# EAGLE design main (EAGLE 6.6.0)
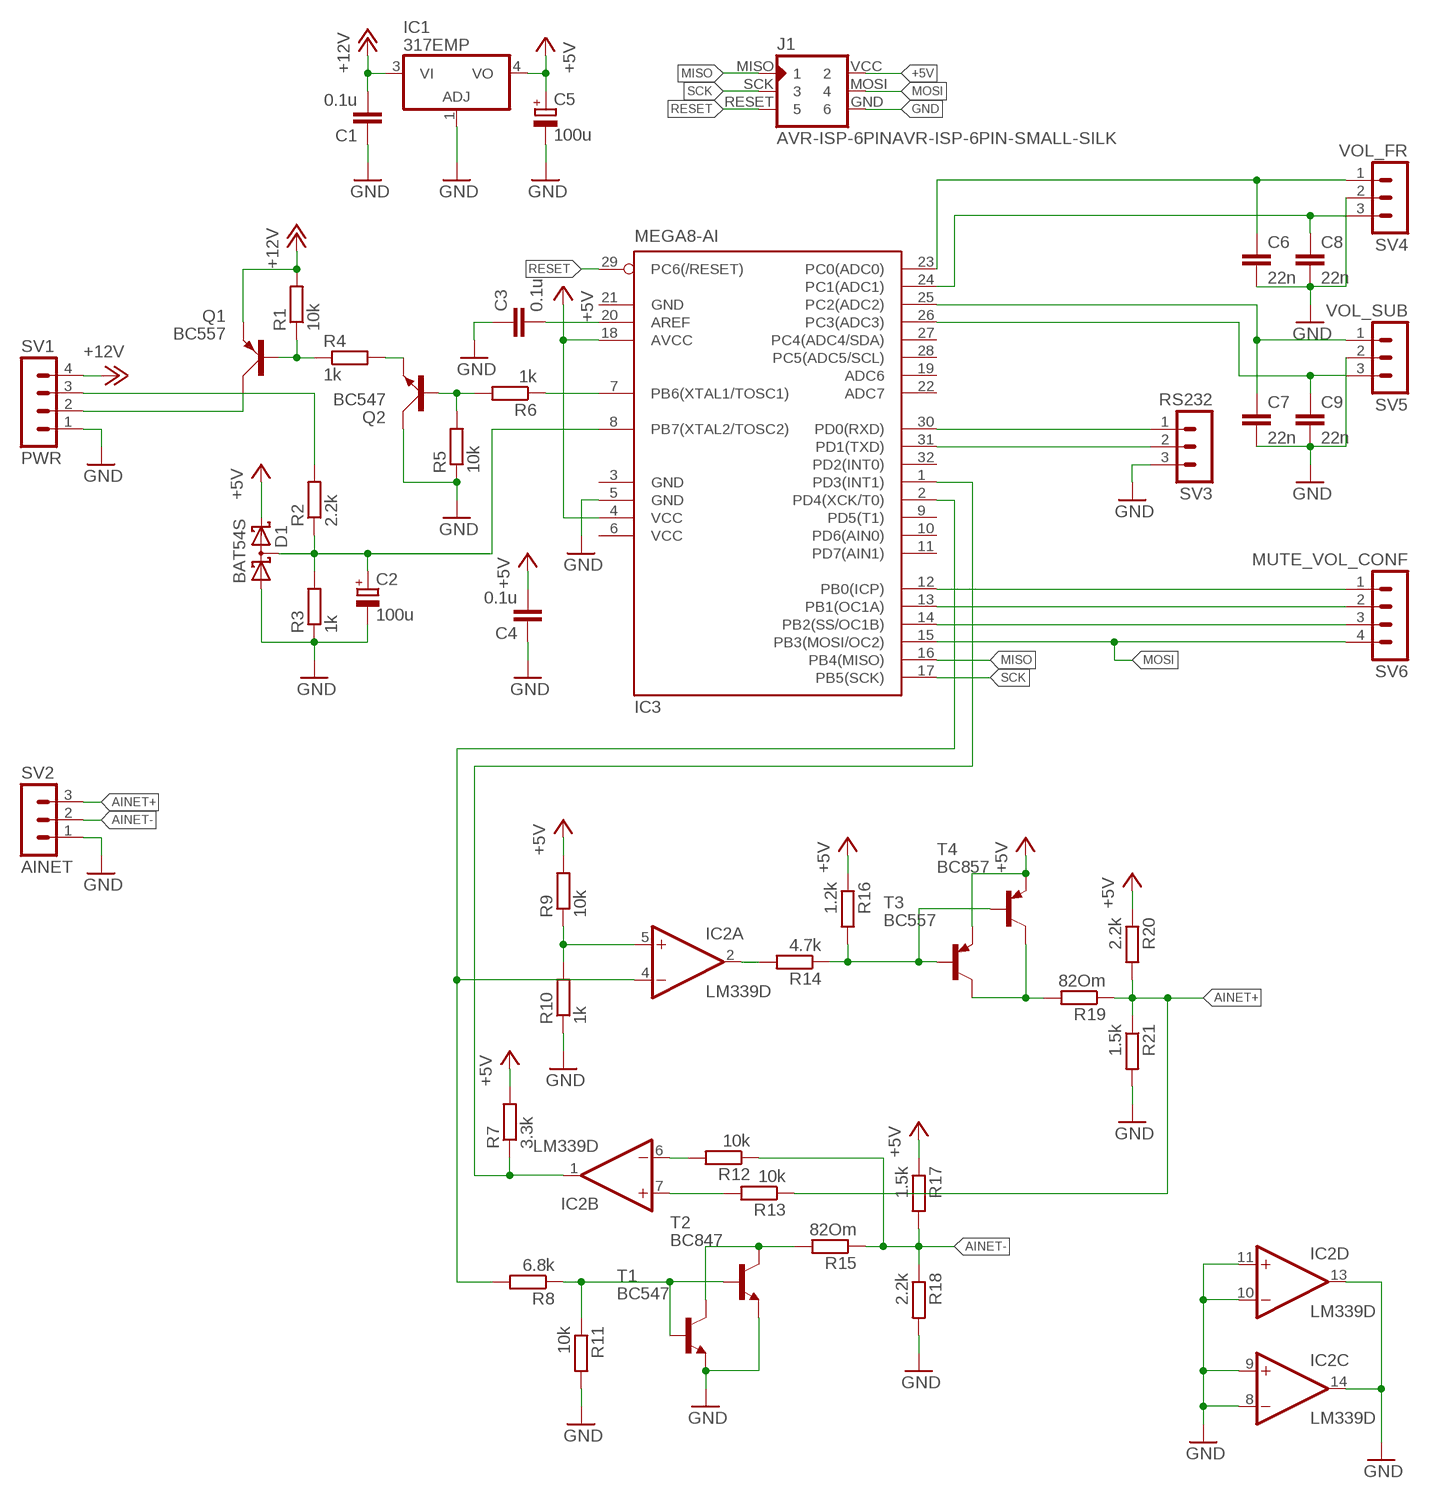
[diagram p0: schematic, sheet 1]

## Parts
C1  0.1u  C-EUC0805  [C0805]
C2  100u  CPOL-EUE3.5-8  [E3,5-8]
C3  0.1u  C-EUC0805  [C0805]
C4  0.1u  C-EUC0805  [C0805]
C5  100u  CPOL-EUE3.5-8  [E3,5-8]
C6  22n  C-EUC0805  [C0805]
C7  22n  C-EUC0805  [C0805]
C8  22n  C-EUC0805  [C0805]
C9  22n  C-EUC0805  [C0805]
D1  BAT54S  [SOT23]
IC1  317EMP  [SOT223]
IC2  LM339D  [SO14]
IC3  MEGA8-AI  [TQFP32-08]
J1  AVR-ISP-6PINAVR-ISP-6PIN-SMALL-SILK  [AVR-ISP-6PIN-SMAILL-SILK]
Q1  BC557  [SOT54A]
Q2  BC547  [SOT54A]
R1  10k  R-EU_R0805  [R0805]
R2  2.2k  R-EU_R0805  [R0805]
R3  1k  R-EU_R0805  [R0805]
R4  1k  R-EU_R0805  [R0805]
R5  10k  R-EU_R0805  [R0805]
R6  1k  R-EU_R0805  [R0805]
R7  3.3k  R-EU_R0805  [R0805]
R8  6.8k  R-EU_R0805  [R0805]
R9  10k  R-EU_R0805  [R0805]
R10  1k  R-EU_R0805  [R0805]
R11  10k  R-EU_R0805  [R0805]
R12  10k  R-EU_R0805  [R0805]
R13  10k  R-EU_R0805  [R0805]
R14  4.7k  R-EU_R0805  [R0805]
R15  82Om  R-EU_R0805  [R0805]
R16  1.2k  R-EU_R0805  [R0805]
R17  1.5k  R-EU_R0805  [R0805]
R18  2.2k  R-EU_R0805  [R0805]
R19  82Om  R-EU_R0805  [R0805]
R20  2.2k  R-EU_R0805  [R0805]
R21  1.5k  R-EU_R0805  [R0805]
SV1  PWR  MA04-1  [MA04-1]
SV2  AINET  MA03-1  [MA03-1]
SV3  RS232  MA03-1  [MA03-1]
SV4  VOL_FR  MA03-1  [MA03-1]
SV5  VOL_SUB  MA03-1  [MA03-1]
SV6  MUTE_VOL_CONF  MA04-1  [MA04-1]
T1  BC547  BC547-NPN-TO92-CBE  [TO92-CBE]
T2  BC847  BC847-NPN-SOT23-BEC  [SOT23-BEC]
T3  BC557  BC557A-PNP-TO92-EBC  [TO92-EBC]
T4  BC857  BC857A-PNP-SOT23-BEC  [SOT23-BEC]

## Nets
+5V: C4.2 C5.+ D1.2(C2) IC1.4(VO) IC3.4(VCC) IC3.18(AVCC) J1.VCC R7.2 R9.2 R16.1 R17.1 R20.1 T3.E T4.E
+12V: C1.2 IC1.3(VI) Q1.E R1.2 SV1.4
AINET+: R13.1 R19.1 R20.2 R21.1 SV2.3
AINET-: R12.1 R15.1 R17.2 R18.1 SV2.2
GND: C1.1 C2.- C3.1 C4.1 C5.- C6.2 C7.2 C8.2 C9.2 D1.1(A1) IC1.1(ADJ) IC2.8(C:-IN) IC2.9(C:+IN) IC2.10(D:-IN) IC2.11(D:+IN) IC2.13(D:OUT) IC2.14(C:OUT) IC3.5(GND) J1.GND Q2.C R3.1 R5.1 R10.1 R11.2 R18.2 R21.2 SV1.1 SV2.1 SV3.3 SV4.2 SV5.2 T1.E T2.E
MISO: IC3.16(PB4(MISO)) J1.MISO
MOSI: IC3.15(PB3(MOSI/OC2)) J1.MOSI SV6.4
N$1: C8.1 IC3.24(PC1(ADC1)) SV4.3
N$2: C6.1 IC3.23(PC0(ADC0)) SV4.1
N$3: C2.+ D1.3(C1A2) IC3.8(PB7(XTAL2/TOSC2)) R2.1 R3.2
N$4: IC3.12(PB0(ICP)) SV6.1
N$5: C9.1 IC3.26(PC3(ADC3)) SV5.3
N$6: C7.1 IC3.25(PC2(ADC2)) SV5.1
N$7: IC3.13(PB1(OC1A)) SV6.2
N$8: IC3.14(PB2(SS/OC1B)) SV6.3
N$9: Q2.B R5.2 R6.2
N$10: R2.2 SV1.3
N$11: IC3.7(PB6(XTAL1/TOSC1)) R6.1
N$12: Q2.E R4.2
N$13: Q1.B R1.1 R4.1
N$14: Q1.C SV1.2
N$15: IC3.30(PD0(RXD)) SV3.1
N$16: C3.2 IC3.20(AREF)
N$18: IC2.5(A:+IN) R9.1 R10.2
N$19: IC2.1(B:OUT) IC3.1(PD3(INT1)) R7.1
N$20: IC2.4(A:-IN) IC3.2(PD4(XCK/T0)) R8.2
N$21: R14.1 R16.2 T3.B T4.B
N$22: IC2.2(A:OUT) R14.2
N$23: IC2.6(B:-IN) R12.2
N$24: R19.2 T3.C T4.C
N$25: IC2.7(B:+IN) R13.2
N$26: IC3.31(PD1(TXD)) SV3.2
N$27: R15.2 T1.C T2.C
N$29: R8.1 R11.1 T1.B T2.B
RESET: IC3.29(PC6(/RESET)) J1.RESET
SCK: IC3.17(PB5(SCK)) J1.SCK
Unconnected: IC3.9(PD5(T1)) IC3.10(PD6(AIN0)) IC3.11(PD7(AIN1)) IC3.19(ADC6) IC3.22(ADC7) IC3.27(PC4(ADC4/SDA)) IC3.28(PC5(ADC5/SCL)) IC3.32(PD2(INT0))

## Power pins joined to a net without a drawn wire
GND: IC2.12(P:GND) IC3.3(GND) IC3.21(GND)
V+: IC2.3(P:V+)
VCC: IC3.6(VCC)

## Library data of the parts
C1 C3 C4 C6-C9 = rcl:C-EU: CAPACITOR, European symbol
C2 C5 = rcl:CPOL-EU: POLARIZED CAPACITOR, European symbol
D1 = diode:BAT54S: Schottky Diodes Pin connection corrected 2011-05-04 Source: Fairchild .. BAT54.pdf
IC1 = linear:*317: Positive VOLTAGE REGULATOR
IC2 = linear:LM339: Low Power Low Offset Voltage Quad Comparators with open collector; LM139/LM239/LM339/LM2901/LM3302
IC3 = atmel:MEGA8: MICROCONTROLLER 8 Kbytes FLASH, 1 kbytes SRAM, 512 bytes EEPROM, USART, 6-channel 10 bit ADC, 2-channel 8 bit ADC Pin compatible with Atmega48, ATMega88, ATMega168 Source: avr.lbr; MPN: ATMEGA8-16AU; OC_FARNELL: 9171371; OC_NEWARK: 73M8863
J1 = avr-isp:AVR-ISP-6PIN: AVR ISP 6pin 3x2 pin header
Q1 = transistor-small-signal:BC557: PNP TRANSISTOR
Q2 = transistor-small-signal:BC547: NPN TRANSISTOR
R1-R21 = rcl:R-EU_: RESISTOR, European symbol
SV1 SV6 = con-lstb:MA04-1: PIN HEADER; OC_FARNELL: unknown; OC_NEWARK: unknown
SV2-SV5 = con-lstb:MA03-1: PIN HEADER; OC_FARNELL: unknown; OC_NEWARK: unknown
T1 T2 = transistor:*-NPN-: NPN Transistror BF959 corrected 2008.03.06
T3 T4 = transistor:*-PNP-: PNP Transistror

## Board
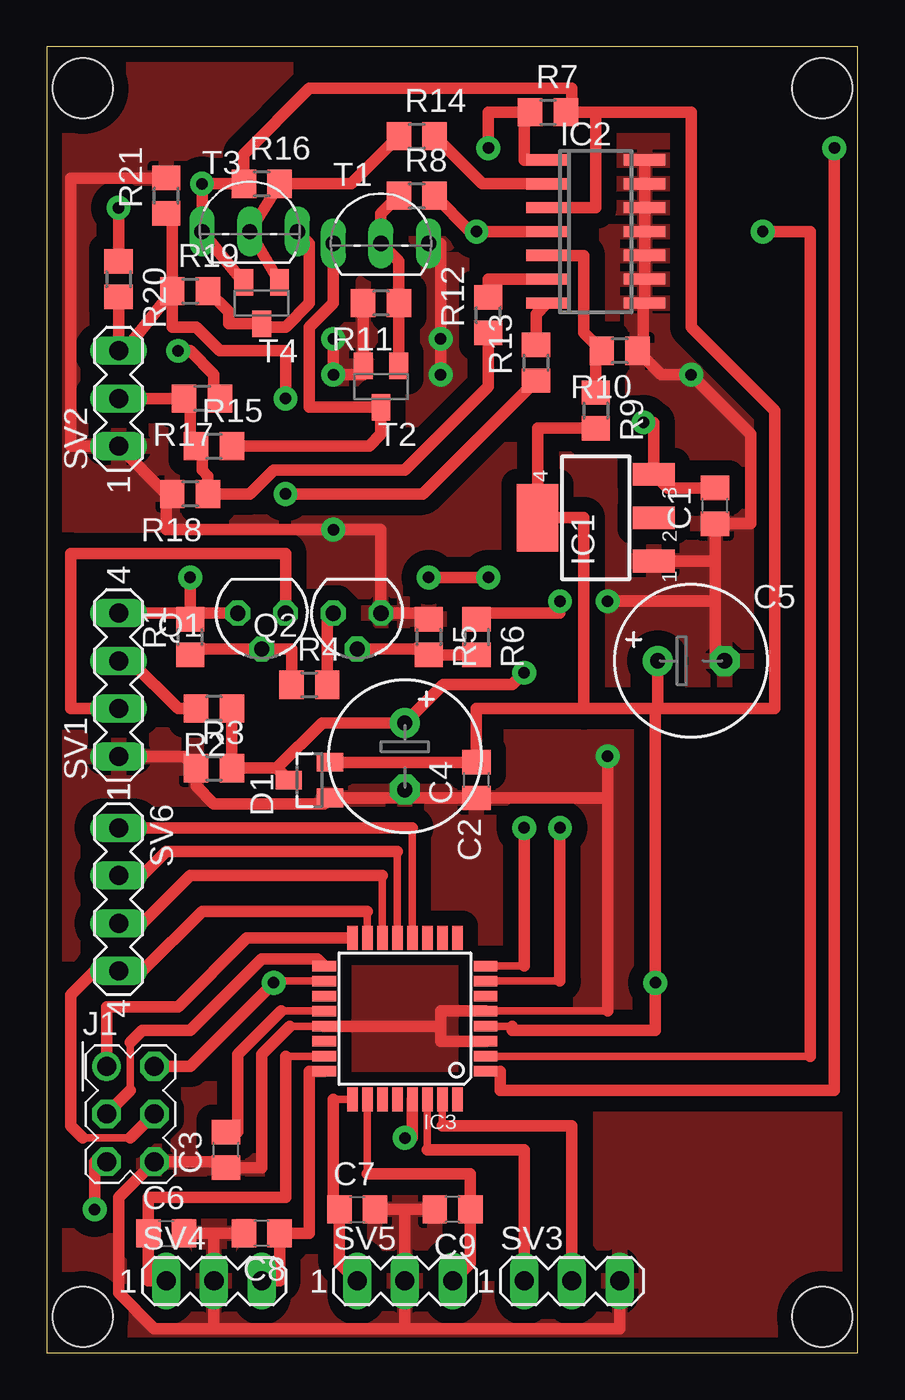
[diagram p1: board, top side]
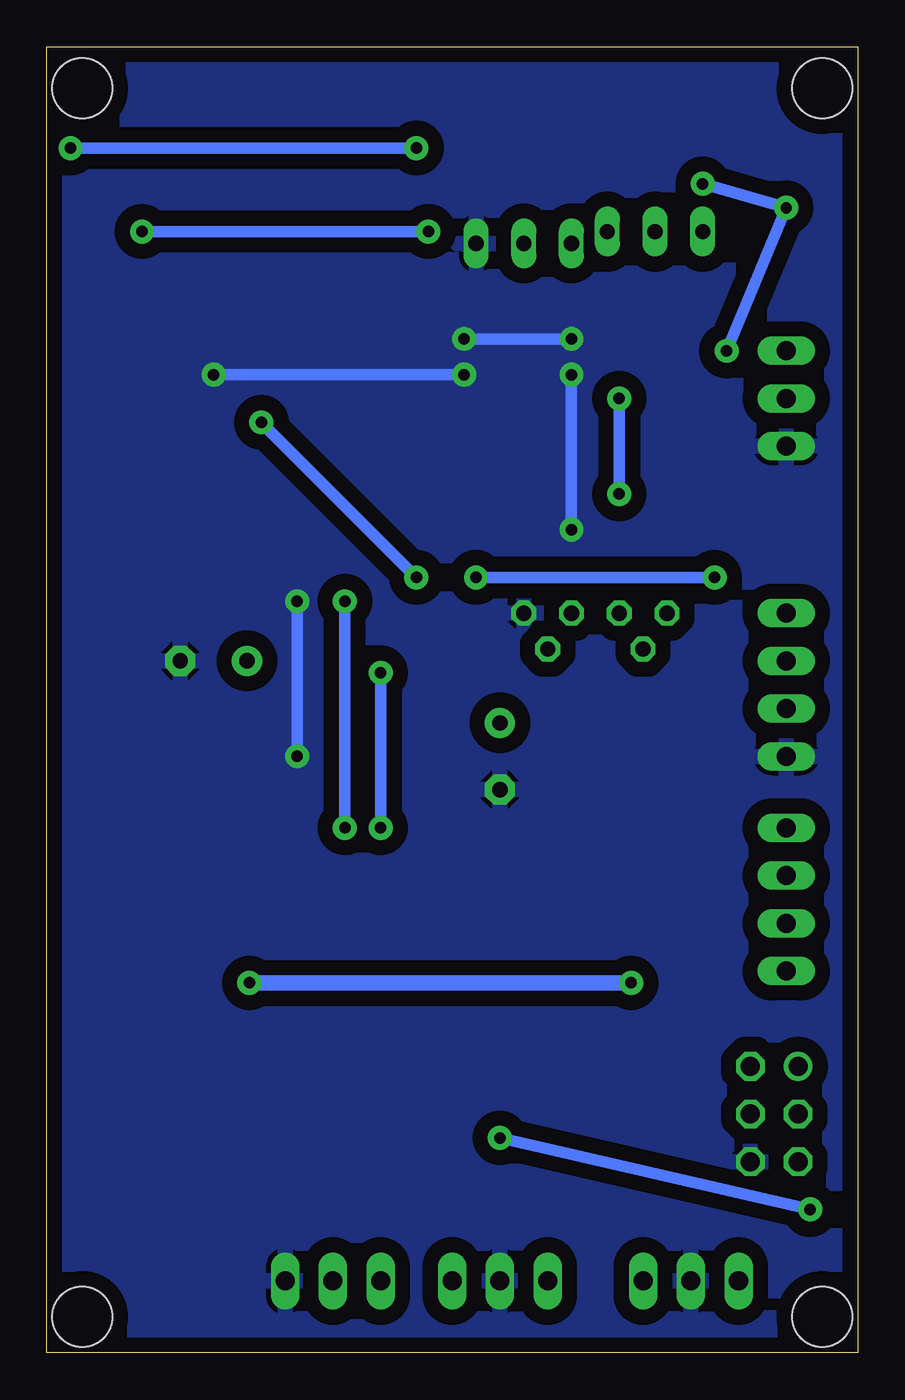
[diagram p2: board, bottom side, seen from below]

Size 43.16 x 69.52 mm. Coordinates in mm from the lower left corner, seen from the top.
Outline: 0,0 43.16,0 43.16,69.52 0,69.52 0,0
Copper layers (1*16): Top 0.035mm / dielectric 1.5mm / Bottom 0.035mm
Design rules "default *": minimum track width 10mil, minimum drill 24mil, track to track 8mil, track to pad 8mil, pad to pad 8mil, via to via 8mil, smd to smd 8mil, copper to edge 0.5mm, drill to drill 8mil, minimum pad ring 10mil, minimum via ring 8mil, stop-mask expansion 4mil, vias tented up to drill 0.5mil, thermal gap 10mil
Holes 3.2 mm at 41.27,1.91 1.91,1.91 1.91,67.31 41.27,67.31

### Footprints (pad centres in the part's own frame; a part is rotated, then mirrored left to right if it is on the bottom)
C0805 = smd 1.3 x 1.5: 1 -0.95,0; 2 0.95,0
E3,5-8 = drill 0.813 pad 1.6: + -1.778,0 | drill 0.813 pad 1.6 octagon: - 1.778,0
SOT23 = smd 1 x 1.4: 1 -0.95,-1.1; 2 0.95,-1.1; 3 0,1.1
SOT223 = smd 1.219 x 2.235: 1 -2.311,-3.099; 2 0,-3.099; 3 2.311,-3.099 | smd 3.6 x 2.2: 4 0,3.099
SO14 = smd 0.6 x 2.2: 1 -3.81,-2.6; 2 -2.54,-2.6; 3 -1.27,-2.6; 4 0,-2.6; 5 1.27,-2.6; 6 2.54,-2.6; 7 3.81,-2.6; 8 3.81,2.6; 9 2.54,2.6; 10 1.27,2.6; 11 0,2.6; 12 -1.27,2.6; 13 -2.54,2.6; 14 -3.81,2.6
TQFP32-08 = smd 1.27 x 0.559: 1 -4.293,2.8; 2 -4.293,2; 3 -4.293,1.2; 4 -4.293,0.4; 5 -4.293,-0.4; 6 -4.293,-1.2; 7 -4.293,-2; 8 -4.293,-2.8; 17 4.293,-2.8; 18 4.293,-2; 19 4.293,-1.2; 20 4.293,-0.4; 21 4.293,0.4; 22 4.293,1.2; 23 4.293,2; 24 4.293,2.8 | smd 0.559 x 1.27: 9 -2.8,-4.293; 10 -2,-4.293; 11 -1.2,-4.293; 12 -0.4,-4.293; 13 0.4,-4.293; 14 1.2,-4.293; 15 2,-4.293; 16 2.8,-4.293; 25 2.8,4.293; 26 2,4.293; 27 1.2,4.293; 28 0.4,4.293; 29 -0.4,4.293; 30 -1.2,4.293; 31 -2,4.293; 32 -2.8,4.293
AVR-ISP-6PIN-SMAILL-SILK = drill 1.016 octagon: GND 1.27,-2.54; MOSI 1.27,0; RESET -1.27,-2.54; SCK -1.27,0; VCC 1.27,2.54 | drill 1.016: MISO -1.27,2.54
SOT54A = drill 0.813 octagon: B 0,1.905; C -1.27,0; E 1.27,0
R0805 = smd 1.3 x 1.5: 1 -0.95,0; 2 0.95,0
MA04-1 = drill 1.016 long: 1 -3.81,0; 2 -1.27,0; 3 1.27,0; 4 3.81,0
MA03-1 = drill 1.016 long: 1 -2.54,0; 2 0,0; 3 2.54,0
TO92-CBE = drill 0.813 long: B 0,0; C -2.54,0; E 2.54,0
SOT23-BEC = smd 1 x 1.4: B -0.95,-1.1; C 0,1.1; E 0.95,-1.1
TO92-EBC = drill 0.813 long: B 0,-1.27; C 2.54,-1.27; E -2.54,-1.27

### Placement (x,y rotation side)
C1  35.56,45.08 90 top
C2  19.05,31.75 270 top
C3  9.53,10.8 90 top
C4  22.86,30.48 90 top
C5  34.29,36.83 0 top
C6  6.35,6.35 0 top
C7  16.51,7.62 0 top
C8  11.43,6.35 180 top
C9  21.59,7.62 180 top
D1  13.97,30.48 90 top
IC1  29.21,44.45 90 top
IC2  29.21,59.69 270 top
IC3  19.05,17.78 180 top
J1  4.45,12.7 0 top
Q1  11.43,39.37 180 top
Q2  16.51,39.37 180 top
R1  7.62,38.1 90 top
R2  8.89,34.29 180 top
R3  8.89,31.12 0 top
R4  13.97,35.56 0 top
R5  20.32,38.1 270 top
R6  22.86,38.1 270 top
R7  26.67,66.04 0 top
R8  19.68,61.59 0 top
R9  29.21,50.17 270 top
R10  30.48,53.34 180 top
R11  17.78,55.88 180 top
R12  23.5,55.25 90 top
R13  26.04,52.7 90 top
R14  19.68,64.77 0 top
R15  8.89,48.26 0 top
R16  11.43,62.23 0 top
R17  8.26,50.8 180 top
R18  7.62,45.72 180 top
R19  7.62,56.52 0 top
R20  3.81,57.15 270 top
R21  6.35,61.59 90 top
SV1  3.81,35.56 90 top
SV2  3.81,50.8 90 top
SV3  27.94,3.81 0 top
SV4  8.89,3.81 0 top
SV5  19.05,3.81 0 top
SV6  3.81,24.13 270 top
T1  17.78,59.06 0 top
T2  17.78,51.44 180 top
T3  10.79,60.96 0 top
T4  11.43,55.88 180 top

### Tracks (layer width: path | path; a pad name or v marks a point on that pad's centre or on a via)
+5V  (via drill 0.61 pad 1.27)
  Top 0.406: IC3.4 24.77,17.38 | IC3.18 12.06,19.78
  Top 0.61: T4.E T3.E v8.26,62.23 R16.1 10.48,63.82 13.97,67.31 27.94,67.31 27.94,66.36 R7.2 29.21,66.04 | v3.81,60.96 R20.1 | v6.99,53.34 7.62,53.34 8.89,52.07 8.89,51.11 R17.1 | 29.21,66.04 34.29,66.04 34.29,54.61 38.73,50.17 38.73,34.29 32.51,34.29 | 29.21,66.04 29.21,60.96 26.67,60.96 | D1.2 C4.2 22.86,34.29 28.57,34.29 | R9.2 26.11,49.22 IC1.4 28.57,44.45 28.57,34.29 | 32.51,34.29 C5.+ | 32.51,34.29 32.38,34.29 | 32.38,34.29 28.57,34.29 | 24.77,17.38 24.77,17.15 32.38,17.15 v32.38,19.69 32.38,34.29 | 12.06,19.78 v12.06,19.69 7.62,15.24 J1.VCC
  Bottom 0.61: v8.26,62.23 v3.81,60.96 v6.99,53.34
  Bottom 0.813: v32.38,19.69 v12.06,19.69
+12V  (via drill 0.61 pad 1.27)
  Top 0.61: Q1.E 7.62,39.37 | SV1.4 7.62,39.37 | 7.62,39.37 R1.2 | v7.62,41.28 7.62,39.37 | 32.08,46.99 IC1.3 | C1.2 33.03,46.03 IC1.3 | v20.32,41.28 v23.5,41.28 | v31.75,49.53 32.31,49.53 IC1.3
  Bottom 0.61: v7.62,41.28 v20.32,41.28 | v31.75,49.53 v23.5,41.28
AINET+  (via drill 0.61 pad 1.27)
  Top 0.61: R20.2 SV2.3 4.13,53.34 R19.1 | R21.1 6.67,60.33 R19.1 | R13.1 20,45.72 v12.7,45.72 | v12.7,50.8 12.7,53.34 9.21,53.34 7.94,54.61 6.67,54.61 R19.1
  Bottom 0.61: v12.7,50.8 v12.7,45.72
AINET-
  Top 0.61: SV2.2 R17.2 7.62,50.48 7.62,48.26 R15.1 8.26,47.94 8.26,46.99 8.57,46.67 R18.1 10.79,45.72 12.06,46.99 19.05,46.99 23.5,51.44 R12.1
GND  (via drill 0.61 pad 1.27)
  Top 0.406: IC3.5 29.84,18.18 | IC3.21 12.94,17.38
  Top 0.61: 19.05,7.62 SV5.2 19.05,1.27 | 19.05,7.62 C9.2 | C7.2 19.05,7.62 | 8.89,1.27 SV4.2 8.89,6.35 | 8.89,1.27 19.05,1.27 | SV3.3 30.48,1.27 19.05,1.27 | IC2.14 IC2.13 IC2.12 IC2.11 IC2.10 IC2.9 IC2.8 31.75,55.88 31.75,53.34 R10.1 32.7,52.07 v34.29,52.07 37.47,48.89 37.47,44.14 C1.1 35.56,42.14 | R21.2 1.27,62.55 1.27,48.26 SV2.1 6.35,45.72 | 6.35,45.72 R18.2 | T1.E 20.95,59.06 v20.95,53.97 v20.95,52.07 | R5.1 20.32,39.37 Q2.C 17.78,43.81 v15.24,43.81 6.35,43.81 6.35,45.72 | SV1.1 7.3,31.75 R3.1 7.94,30.16 8.89,29.21 14.75,29.21 D1.1 18.61,29.53 C2.- 19.49,29.53 C4.1 29.84,29.53 | IC1.1 35.56,42.14 | C5.- 35.56,36.83 35.56,40 | 35.56,40 35.56,42.14 | v15.24,53.97 v15.24,52.07 16.83,52.07 T2.E R11.2 | IC3.5 20.95,18.18 20.95,17.38 | 20.95,17.38 20.95,16.58 IC3.3 | IC3.21 20.95,17.38 | 29.84,29.53 v29.84,31.75 | 29.84,18.18 29.84,29.53 | v29.84,40 35.56,40 | 8.89,1.27 5.71,1.27 3.81,3.17 3.81,8.26 J1.GND 9.53,10.16 C3.1 11.43,9.84 11.43,15.88 12.94,17.38 | C8.2 8.89,6.35 | 8.89,6.35 C6.2
  Bottom 0.61: v20.95,53.97 v15.24,53.97 | v34.29,52.07 v20.95,52.07 | v15.24,52.07 v15.24,43.81 | v29.84,40 v29.84,31.75
  pour Bottom (isolate 0.813): 0.64,68.58 42.55,68.58 42.55,0.63 0.64,0.63
  pour Top (isolate 0.813): 0.64,68.58 42.55,68.58 42.55,0.63 0.64,0.63
MISO
  Top 0.61: J1.MISO 3.17,18.41 6.99,18.41 10.64,22.07 IC3.16
MOSI
  Top 0.406: IC3.15 17.05,23.49 | 4.45,11.43 1.91,11.43
  Top 0.61: 17.05,23.49 8.26,23.49 5.08,20.32 SV6.4 2.54,20.32 1.27,19.05 1.27,12.06 1.91,11.43 | J1.MOSI 4.45,11.43
N$1
  Top 0.61: SV4.3 12.38,3.81 C8.1 13.97,6.35 13.97,14.98 IC3.24
N$2
  Top 0.406: IC3.23 12.7,15.78
  Top 0.61: SV4.1 5.4,3.81 C6.1 5.4,8.26 12.7,8.26 12.7,15.78
N$3  (via drill 0.61 pad 1.27)
  Top 0.406: IC3.8 25.4,20.58
  Top 0.61: R2.1 R3.2 12.23,31.12 | 12.23,31.12 D1.3 | 12.23,31.12 14.65,33.53 C2.+ 21.08,35.56 24.77,35.56 v25.4,36.19 | 25.4,20.58 v25.4,27.94
  Bottom 0.61: v25.4,36.19 v25.4,27.94
N$4
  Top 0.406: IC3.12 19.45,27.94
  Top 0.61: 19.45,27.94 SV6.1
N$5
  Top 0.406: IC3.26 17.05,9.52
  Top 0.61: SV5.3 22.54,4.76 C9.1 22.54,9.52 17.05,9.52
N$6
  Top 0.406: 15.24,13.49 IC3.25
  Top 0.61: SV5.1 15.56,4.76 C7.1 15.24,7.62 15.24,13.49
N$7
  Top 0.406: IC3.13 18.65,26.67
  Top 0.61: SV6.2 5.08,25.4 6.35,26.67 18.65,26.67
N$8
  Top 0.406: IC3.14 17.85,25.4
  Top 0.61: SV6.3 5.08,22.86 7.62,25.4 17.85,25.4
N$9
  Top 0.61: Q2.B 20.32,37.47 R5.2 R6.2
N$10
  Top 0.61: SV1.3 4.45,36.83 6.99,34.29 R2.2
N$11  (via drill 0.61 pad 1.27)
  Top 0.406: IC3.7 27.3,19.78
  Top 0.61: R6.1 22.86,39.37 27.3,39.37 v27.3,40 | 27.3,19.78 v27.3,27.94
  Bottom 0.61: v27.3,27.94 v27.3,40
N$12
  Top 0.61: Q2.E 14.92,39.37 R4.2
N$13
  Top 0.61: R1.1 7.62,37.47 Q1.B 13.02,37.47 R4.1
N$14
  Top 0.61: Q1.C 12.7,42.55 1.27,42.55 1.27,34.29 SV1.2
N$15
  Top 0.406: IC3.30 20.25,10.8
  Top 0.61: 20.25,10.8 25.4,10.8 SV3.1
N$16
  Top 0.406: IC3.20 12.46,18.18
  Top 0.61: 12.46,18.18 10.16,15.88 10.16,11.74 C3.2
N$18
  Top 0.61: IC2.5 28.57,58.42 28.57,54.3 R10.2 29.21,53.02 R9.1
N$19  (via drill 0.61 pad 1.27)
  Top 0.406: IC3.1 24.13,14.98
  Top 0.61: R7.1 25.4,66.04 | 25.4,66.04 25.4,63.5 IC2.1 | 24.13,14.98 24.13,13.97 41.91,13.97 v41.91,64.14 | 25.4,66.04 23.5,66.04 v23.5,64.14
  Bottom 0.61: v23.5,64.14 v41.91,64.14
N$20  (via drill 0.61 pad 1.27)
  Top 0.406: IC3.2 40.64,15.78
  Top 0.61: R8.2 22.54,59.69 v22.86,59.69 IC2.4 | 40.64,15.78 40.64,59.69 v38.1,59.69
  Bottom 0.61: v22.86,59.69 v38.1,59.69
N$21
  Top 0.61: R14.1 16.2,62.23 R16.2 T3.B T4.B
N$22
  Top 0.61: IC2.2 23.18,62.23 R14.2
N$23
  Top 0.61: R12.2 23.5,57.15 IC2.6
N$24
  Top 0.61: T3.C 13.97,59.06 13.97,55.88 12.7,54.61 11.6,54.61 T4.C 9.67,54.78 9.67,55.42 R19.2
N$25
  Top 0.61: IC2.7 26.04,55.31 R13.2
N$26
  Top 0.406: IC3.31 21.05,12.06
  Top 0.61: 21.05,12.06 27.94,12.06 SV3.2
N$27
  Top 0.61: T1.C 15.24,55.88 13.97,54.61 13.97,50.33 T2.C 17.78,48.89 17.14,48.26 R15.2
N$29
  Top 0.61: T2.B R11.1 18.73,58.11 T1.B 17.78,60.64 R8.1
RESET  (via drill 0.61 pad 1.27)
  Top 0.61: J1.RESET 2.54,10.16 v2.54,7.62 | IC3.29 19.45,11.43 v19.05,11.43
  Bottom 0.61: v2.54,7.62 v19.05,11.43
SCK
  Top 0.406: 4.45,16.51 4.45,13.97
  Top 0.61: IC3.17 14.38,20.95 11.43,20.95 7.62,17.15 5.08,17.15 4.45,16.51 | 4.45,13.97 J1.SCK